# EAGLE design nixie-tube-clock (EAGLE 7.5.0)
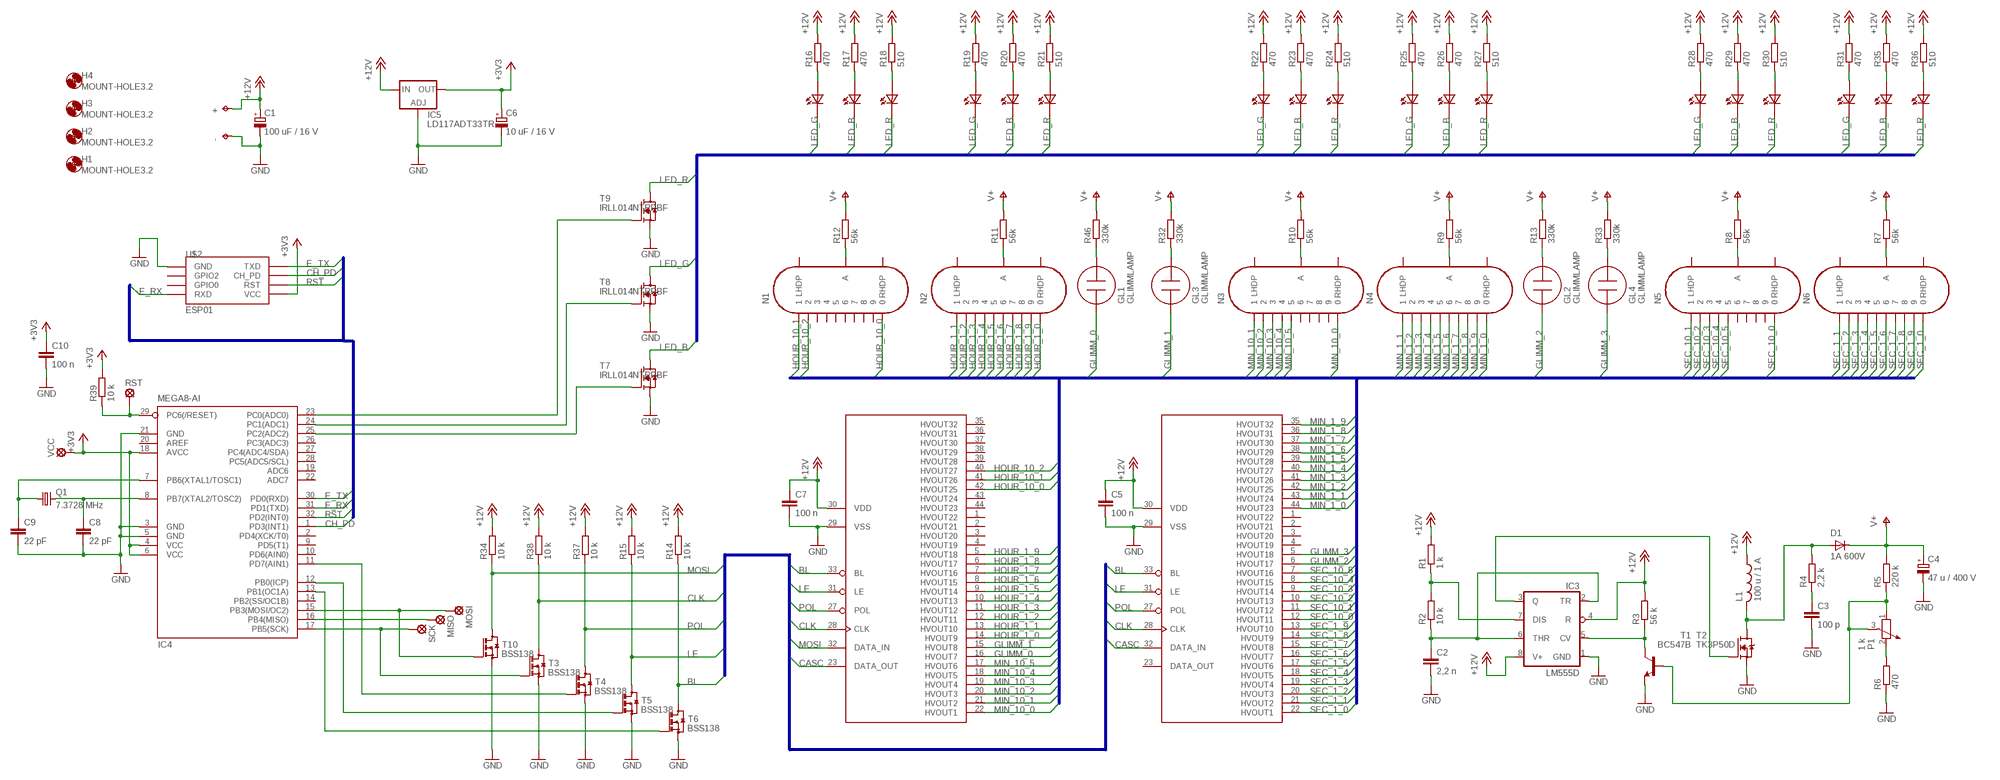
[diagram p0: schematic, sheet 1]

## Parts
+  +  TPPAD1-17  [P1-17]
-  -  TPPAD1-17  [P1-17]
C1  100 uF / 16 V  CPOL-EU153CLV-0605  [153CLV-0605]
C2  2,2 n  C-EUC1206  [C1206]
C3  100 p  C-EUC1206  [C1206]
C4  47 u / 400 V  CPOL-EUE7.5-16  [E7,5-16]
C5  100 n  C-EUC1206  [C1206]
C6  10 uF / 16 V  CPOL-EU153CLV-0405  [153CLV-0405]
C7  100 n  C-EUC1206  [C1206]
C8  22 pF  C-EUC1206  [C1206]
C9  22 pF  C-EUC1206  [C1206]
C10  100 n  C-EUC1206  [C1206]
D1  1A 600V  GF1  [SMA-DO214AC]
GL1  GLIMMLAMP  [GLIMMLAMP]
GL2  GLIMMLAMP  [GLIMMLAMP]
GL3  GLIMMLAMP  [GLIMMLAMP]
GL4  GLIMMLAMP  [GLIMMLAMP]
H1  MOUNT-HOLE3.2  [3,2]
H2  MOUNT-HOLE3.2  [3,2]
H3  MOUNT-HOLE3.2  [3,2]
H4  MOUNT-HOLE3.2  [3,2]
IC1  HV5622QC  [PQFP44]
IC2  HV5622QC  [PQFP44]
IC3  LM555D  [SO08]
IC4  MEGA8-AI  [TQFP32-08]
IC5  LD117ADT33TR  [DPACK]
L1  100 u / 1 A  L_V_8.7X12_RM5.0  [L_V_8.7X12_RM5.0]
MISO  MISO  SE11  [SE11]
MOSI  MOSI  SE11  [SE11]
N1  IN-14  [IN-14]
N2  IN-14  [IN-14]
N3  IN-14  [IN-14]
N4  IN-14  [IN-14]
N5  IN-14  [IN-14]
N6  IN-14  [IN-14]
P1  1 k  POTENTIOMETER_PT-10  [PT-10]
Q1  7.3728 MHz  CRYSTALHC49S  [HC49/S]
R1  1 k  R-EU_R1206  [R1206]
R2  10 k  R-EU_R1206  [R1206]
R3  56 k  R-EU_R1206  [R1206]
R4  2,2 k  R-EU_R1206  [R1206]
R5  220 k  R-EU_R1206  [R1206]
R6  470  R-EU_R1206  [R1206]
R7  56k  R-EU_R1206  [R1206]
R8  56k  R-EU_R1206  [R1206]
R9  56k  R-EU_R1206  [R1206]
R10  56k  R-EU_R1206  [R1206]
R11  56k  R-EU_R1206  [R1206]
R12  56k  R-EU_R1206  [R1206]
R13  330k  R-EU_R1206  [R1206]
R14  10 k  R-EU_R1206  [R1206]
R15  10 k  R-EU_R1206  [R1206]
R16  470  R-EU_R1206  [R1206]
R17  470  R-EU_R1206  [R1206]
R18  510  R-EU_R1206  [R1206]
R19  470  R-EU_R1206  [R1206]
R20  470  R-EU_R1206  [R1206]
R21  510  R-EU_R1206  [R1206]
R22  470  R-EU_R1206  [R1206]
R23  470  R-EU_R1206  [R1206]
R24  510  R-EU_R1206  [R1206]
R25  470  R-EU_R1206  [R1206]
R26  470  R-EU_R1206  [R1206]
R27  510  R-EU_R1206  [R1206]
R28  470  R-EU_R1206  [R1206]
R29  470  R-EU_R1206  [R1206]
R30  510  R-EU_R1206  [R1206]
R31  470  R-EU_R1206  [R1206]
R32  330k  R-EU_R1206  [R1206]
R33  330k  R-EU_R1206  [R1206]
R34  10 k  R-EU_R1206  [R1206]
R35  470  R-EU_R1206  [R1206]
R36  510  R-EU_R1206  [R1206]
R37  10 k  R-EU_R1206  [R1206]
R38  10 k  R-EU_R1206  [R1206]
R39  10 k  R-EU_R1206  [R1206]
R46  330k  R-EU_R1206  [R1206]
RST  RST  SE11  [SE11]
SCK  SCK  SE11  [SE11]
T1  BC547B  BC817-NPN-SOT23-BEC  [SOT23-BEC]
T2  TK3P50D  IRFR320PBF  [TO252]
T3  BSS138  BSS123  [SOT23]
T4  BSS138  BSS123  [SOT23]
T5  BSS138  BSS123  [SOT23]
T6  BSS138  BSS123  [SOT23]
T7  IRLL014NTRPBF  [SOT223]
T8  IRLL014NTRPBF  [SOT223]
T9  IRLL014NTRPBF  [SOT223]
T10  BSS138  BSS123  [SOT23]
U$1  OF-SMD5060RGB  [OF-SMD5060RGB]
U$2  ESP01  [ESP01]
U$3  OF-SMD5060RGB  [OF-SMD5060RGB]
U$4  OF-SMD5060RGB  [OF-SMD5060RGB]
U$5  OF-SMD5060RGB  [OF-SMD5060RGB]
U$6  OF-SMD5060RGB  [OF-SMD5060RGB]
U$7  OF-SMD5060RGB  [OF-SMD5060RGB]
VCC  VCC  SE11  [SE11]

## Nets
+3V3: C6.+ C10.1 IC4.4(VCC) IC4.6(VCC) IC4.18(AVCC) IC5.4(OUT) R39.2 U$2.VCC VCC.MP
+12V: +.TP C1.+ C5.1 C7.1 IC1.30(VDD) IC2.30(VDD) IC3.4(R) IC3.8(V+) IC5.3(IN) L1.P$1 R1.2 R3.2 R14.2 R15.2 R16.2 R17.2 R18.2 R19.2 R20.2 R21.2 R22.2 R23.2 R24.2 R25.2 R26.2 R27.2 R28.2 R29.2 R30.2 R31.2 R34.2 R35.2 R36.2 R37.2 R38.2
BL: IC1.33(BL) IC2.33(BL) R14.1 T6.3(D)
CASC: IC1.23(DATA_OUT) IC2.32(DATA_IN)
CH_PD: IC4.1(PD3(INT1)) U$2.CH_PD
CLK: IC1.28(CLK) IC2.28(CLK) R38.1 T3.3(D)
E_RX: IC4.31(PD1(TXD)) U$2.RX(RXD)
E_TX: IC4.30(PD0(RXD)) U$2.TX(TXD)
GLIMM_0: GL1.C IC1.16(HVOUT7)
GLIMM_1: GL3.C IC1.15(HVOUT8)
GLIMM_2: GL2.C IC2.6(HVOUT17)
GLIMM_3: GL4.C IC2.5(HVOUT18)
GND: -.TP C1.- C2.2 C3.2 C4.- C5.2 C6.- C7.2 C8.2 C9.2 C10.2 IC1.29(VSS) IC2.29(VSS) IC3.1(GND) IC4.3(GND) IC4.5(GND) IC4.21(GND) IC5.1(ADJ) R6.1 T1.E T2.2(S) T3.2(S) T4.2(S) T5.2(S) T6.2(S) T7.3(S) T8.3(S) T9.3(S) T10.2(S) U$2.GND
HOUR_1_0: IC1.14(HVOUT9) N2.0
HOUR_1_1: IC1.13(HVOUT10) N2.1
HOUR_1_2: IC1.12(HVOUT11) N2.2
HOUR_1_3: IC1.11(HVOUT12) N2.3
HOUR_1_4: IC1.10(HVOUT13) N2.4
HOUR_1_5: IC1.9(HVOUT14) N2.5
HOUR_1_6: IC1.8(HVOUT15) N2.6
HOUR_1_7: IC1.7(HVOUT16) N2.7
HOUR_1_8: IC1.6(HVOUT17) N2.8
HOUR_1_9: IC1.5(HVOUT18) N2.9
HOUR_10_0: IC1.42(HVOUT25) N1.0
HOUR_10_1: IC1.41(HVOUT26) N1.1
HOUR_10_2: IC1.40(HVOUT27) N1.2
LE: IC1.31(LE) IC2.31(LE) R15.1 T5.3(D)
LED_B: T7.2(D) T7.4(D) U$1.B_CATH(B:CATH) U$3.B_CATH(B:CATH) U$4.B_CATH(B:CATH) U$5.B_CATH(B:CATH) U$6.B_CATH(B:CATH) U$7.B_CATH(B:CATH)
LED_D0: IC4.23(PC0(ADC0)) T9.1(G)
LED_D1: IC4.24(PC1(ADC1)) T8.1(G)
LED_D2: IC4.25(PC2(ADC2)) T7.1(G)
LED_G: T8.2(D) T8.4(D) U$1.G_CATH(G:CATH) U$3.G_CATH(G:CATH) U$4.G_CATH(G:CATH) U$5.G_CATH(G:CATH) U$6.G_CATH(G:CATH) U$7.G_CATH(G:CATH)
LED_R: T9.2(D) T9.4(D) U$1.R_CATH(R:CATH) U$3.R_CATH(R:CATH) U$4.R_CATH(R:CATH) U$5.R_CATH(R:CATH) U$6.R_CATH(R:CATH) U$7.R_CATH(R:CATH)
MIN_1_0: IC2.44(HVOUT23) N4.0
MIN_1_1: IC2.43(HVOUT24) N4.1
MIN_1_2: IC2.42(HVOUT25) N4.2
MIN_1_3: IC2.41(HVOUT26) N4.3
MIN_1_4: IC2.40(HVOUT27) N4.4
MIN_1_5: IC2.39(HVOUT28) N4.5
MIN_1_6: IC2.38(HVOUT29) N4.6
MIN_1_7: IC2.37(HVOUT30) N4.7
MIN_1_8: IC2.36(HVOUT31) N4.8
MIN_1_9: IC2.35(HVOUT32) N4.9
MIN_10_0: IC1.22(HVOUT1) N3.0
MIN_10_1: IC1.21(HVOUT2) N3.1
MIN_10_2: IC1.20(HVOUT3) N3.2
MIN_10_3: IC1.19(HVOUT4) N3.3
MIN_10_4: IC1.18(HVOUT5) N3.4
MIN_10_5: IC1.17(HVOUT6) N3.5
MOSI: IC1.32(DATA_IN) R34.1 T10.3(D)
N$2: IC4.29(PC6(/RESET)) R39.1 RST.MP
N$3: IC3.7(DIS) R1.1 R2.2
N$4: IC3.5(CV) R3.1 T1.C
N$5: C2.1 IC3.2(TR) IC3.6(THR) R2.1
N$6: IC3.3(Q) T2.1(G)
N$7: D1.A L1.P$2 R4.2 T2.3(D)
N$8: P1.1 P1.3 R5.1 T1.B
N$9: C3.1 R4.1
N$10: P1.2 R6.2
N$11: N1.A R12.1
N$12: N2.A R11.1
N$13: N3.A R10.1
N$14: N4.A R9.1
N$15: N5.A R8.1
N$16: N6.A R7.1
N$17: IC4.16(PB4(MISO)) MISO.MP
N$18: GL2.A R13.1
N$19: IC4.13(PB1(OC1A)) T6.1(G)
N$20: R16.1 U$1.G_ANODE(G:ANODE)
N$21: R17.1 U$1.B_ANODE(B:ANODE)
N$22: R18.1 U$1.R_ANODE(R:ANODE)
N$23: C8.1 IC4.8(PB7(XTAL2/TOSC2)) Q1.2
N$24: GL3.A R32.1
N$26: R19.1 U$3.G_ANODE(G:ANODE)
N$27: R20.1 U$3.B_ANODE(B:ANODE)
N$28: R21.1 U$3.R_ANODE(R:ANODE)
N$29: IC4.12(PB0(ICP)) T5.1(G)
N$30: GL4.A R33.1
N$31: C9.1 IC4.7(PB6(XTAL1/TOSC1)) Q1.1
N$32: R22.1 U$4.G_ANODE(G:ANODE)
N$33: R23.1 U$4.B_ANODE(B:ANODE)
N$34: R24.1 U$4.R_ANODE(R:ANODE)
N$35: IC4.17(PB5(SCK)) SCK.MP T3.1(G)
N$38: R25.1 U$5.G_ANODE(G:ANODE)
N$39: R26.1 U$5.B_ANODE(B:ANODE)
N$40: R27.1 U$5.R_ANODE(R:ANODE)
N$41: IC4.15(PB3(MOSI/OC2)) MOSI.MP T10.1(G)
N$43: IC4.11(PD7(AIN1)) T4.1(G)
N$44: R28.1 U$6.G_ANODE(G:ANODE)
N$45: R29.1 U$6.B_ANODE(B:ANODE)
N$46: R30.1 U$6.R_ANODE(R:ANODE)
N$50: R31.1 U$7.G_ANODE(G:ANODE)
N$51: R35.1 U$7.B_ANODE(B:ANODE)
N$52: R36.1 U$7.R_ANODE(R:ANODE)
N$146: GL1.A R46.1
POL: IC1.27(POL) IC2.27(POL) R37.1 T4.3(D)
RST: IC4.32(PD2(INT0)) U$2.RST
SEC_1_0: IC2.22(HVOUT1) N6.0
SEC_1_1: IC2.21(HVOUT2) N6.1
SEC_1_2: IC2.20(HVOUT3) N6.2
SEC_1_3: IC2.19(HVOUT4) N6.3
SEC_1_4: IC2.18(HVOUT5) N6.4
SEC_1_5: IC2.17(HVOUT6) N6.5
SEC_1_6: IC2.16(HVOUT7) N6.6
SEC_1_7: IC2.15(HVOUT8) N6.7
SEC_1_8: IC2.14(HVOUT9) N6.8
SEC_1_9: IC2.13(HVOUT10) N6.9
SEC_10_0: IC2.12(HVOUT11) N5.0
SEC_10_1: IC2.11(HVOUT12) N5.1
SEC_10_2: IC2.10(HVOUT13) N5.2
SEC_10_3: IC2.9(HVOUT14) N5.3
SEC_10_4: IC2.8(HVOUT15) N5.4
SEC_10_5: IC2.7(HVOUT16) N5.5
V+: C4.+ D1.K(C) R5.2 R7.2 R8.2 R9.2 R10.2 R11.2 R12.2 R13.2 R32.2 R33.2 R46.2
Unconnected: IC1.1(HVOUT22) IC1.2(HVOUT21) IC1.3(HVOUT20) IC1.4(HVOUT19) IC1.35(HVOUT32) IC1.36(HVOUT31) IC1.37(HVOUT30) IC1.38(HVOUT29) IC1.39(HVOUT28) IC1.43(HVOUT24) IC1.44(HVOUT23) IC2.1(HVOUT22) IC2.2(HVOUT21) IC2.3(HVOUT20) IC2.4(HVOUT19) IC2.23(DATA_OUT) IC4.2(PD4(XCK/T0)) IC4.9(PD5(T1)) IC4.10(PD6(AIN0)) IC4.14(PB2(SS/OC1B)) IC4.19(ADC6) IC4.20(AREF) IC4.22(ADC7) IC4.26(PC3(ADC3)) IC4.27(PC4(ADC4/SDA)) IC4.28(PC5(ADC5/SCL)) N1.3 N1.4 N1.5 N1.6 N1.7 N1.8 N1.9 N1.LHDP N1.RHDP N2.LHDP N2.RHDP N3.6 N3.7 N3.8 N3.9 N3.LHDP N3.RHDP N4.LHDP N4.RHDP N5.6 N5.7 N5.8 N5.9 N5.LHDP N5.RHDP N6.LHDP N6.RHDP U$2.GPIO0 U$2.GPIO2

## Buses
SEC_1_[0..9],SEC_10_[0..5],MIN_1_[0..9],MIN_10_[0..5],HOUR_1_[0..9],HOUR_10_[0..2],GLIMM_[0..3]
LED_R,LED_G,LED_B
CLK,BL,LE,MOSI,CASC,POL
RST,E_RX,E_TX,CH_PD

## Library data of the parts
+ - = testpad:TP: Test pad
C1 C4 C6 = resistor:CPOL-EU: POLARIZED CAPACITOR, European symbol
C2 = rcl:C-EU: CAPACITOR, European symbol
C3 C5 C7-C10 = resistor:C-EU: CAPACITOR, European symbol
D1 = diode:GF1: DIODE
GL1-GL4 = 00_own:GLIMMLAMP
H1-H4 = holes:MOUNT-HOLE: MOUNTING HOLE with drill center marker
IC1 IC2 = microchip-hv5622:HV5622
IC3 = linear:*555: TIMER
IC4 = atmel:MEGA8: MICROCONTROLLER 8 Kbytes FLASH, 1 kbytes SRAM, 512 bytes EEPROM, USART, 6-channel 10 bit ADC, 2-channel 8 bit ADC Pin compatible with Atmega48, ATMega88, ATMega168 Source: avr.lbr; MPN: ATMEGA8-16AU; OC_FARNELL: 9171371; OC_NEWARK: 73M8863
IC5 = v-reg:LD117A?*: Low drop fixed and adjustable positive voltage regulators 1 A Source: http://www.st.com/stonline/products/literature/ds/7194/ld1117axx.pdf
L1 = 00_own:L_V_8.7X12_RM5.0
MISO MOSI RST SCK VCC = solpad:SE11: SOLDER PAD RTM, drill 1,1mm, distributor Buerklin, 07F810
N1-N6 = russian-nixies:IN-14: IN-14: medium numeric frontview nixie tube
P1 = rcl:POTENTIOMETER_: Potentiometer
Q1 = crystal:CRYSTAL: CRYSTAL; OC_FARNELL: 1667008; OC_NEWARK: unknown
R1-R39 R46 = resistor:R-EU_: RESISTOR, European symbol
T1 = transistor:*-NPN-: NPN Transistror BF959 corrected 2008.03.06
T2 = transistor-fet:IRFR320PBF
T3-T6 T10 = transistor-small-signal:BSS123: N-CHANNEL MOS FET
T7-T9 = transistor-fet:IRLL014NTRPBF
U$1 U$3-U$7 = 00_own:OF-SMD5060RGB
U$2 = esp8266modules:ESP01: ESP8266 Wifi module 01

## Board
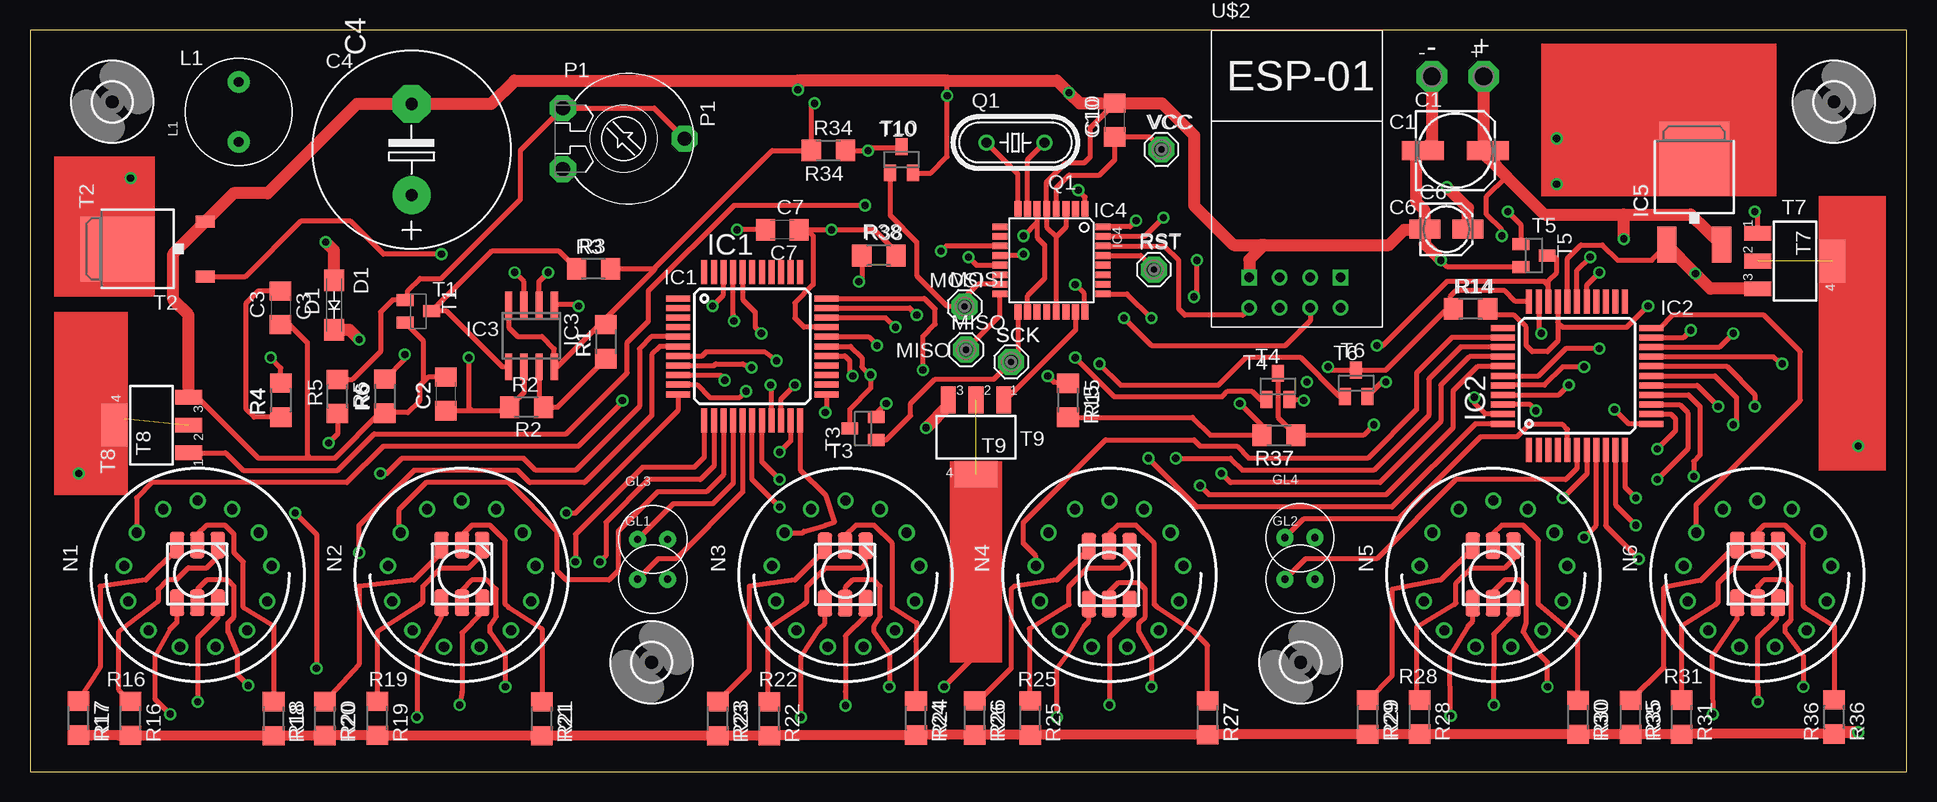
[diagram p1: board, top side]
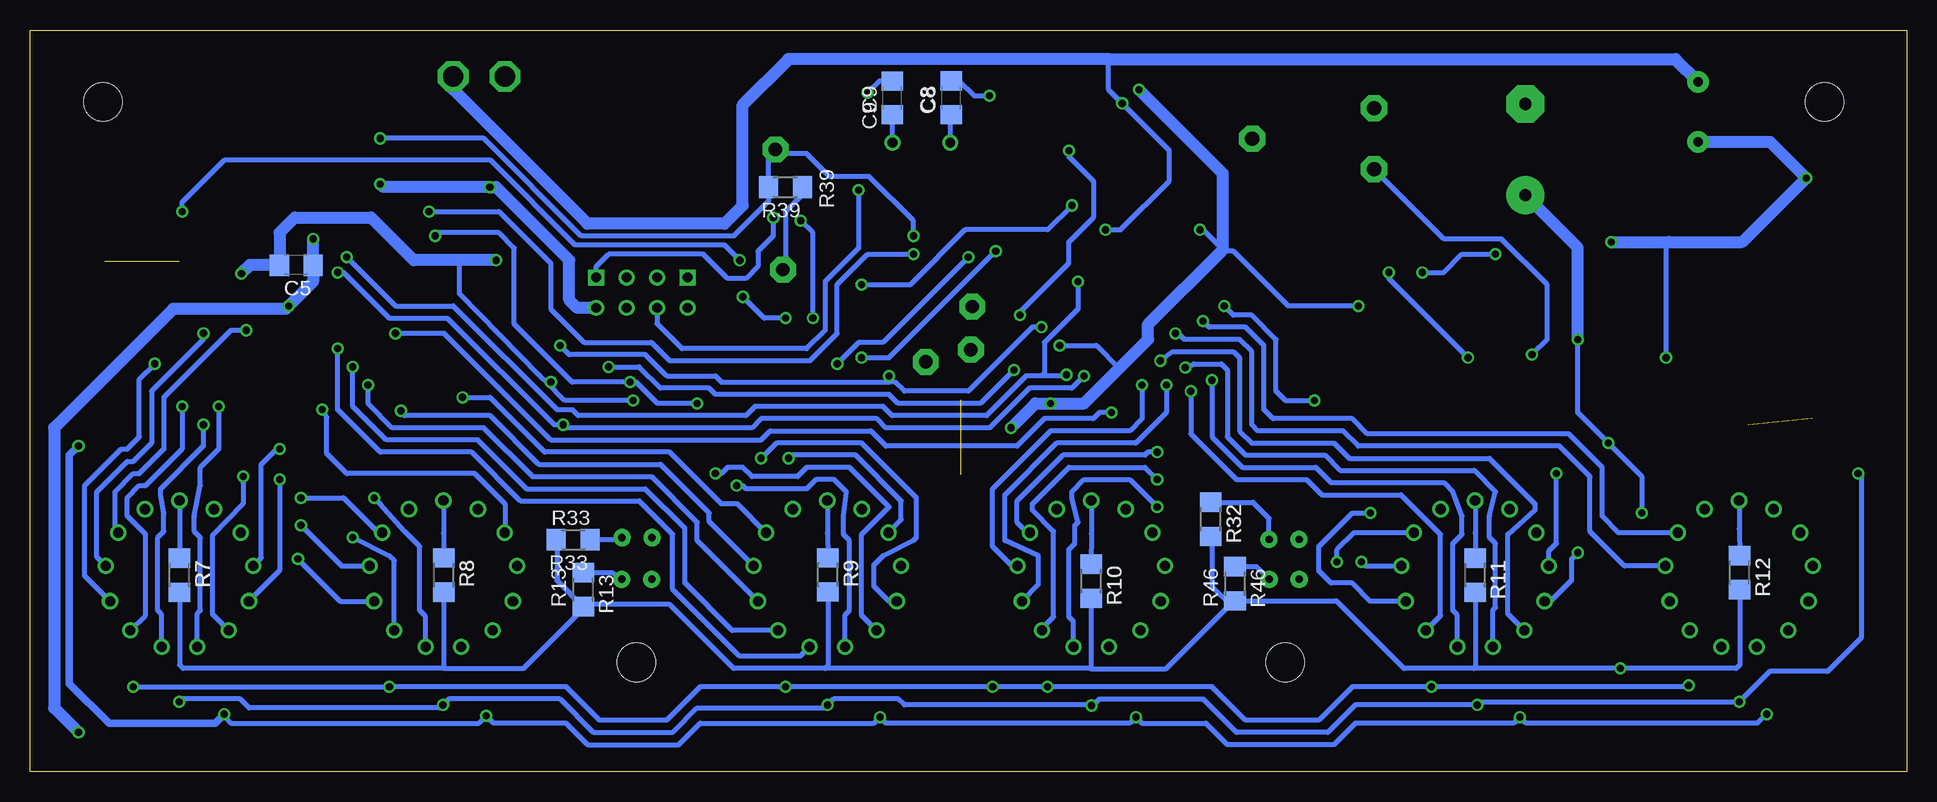
[diagram p2: board, bottom side, seen from below]

Size 156.44 x 61.87 mm. Coordinates in mm from the lower left corner, seen from the top.
Outline: 0,0 156.44,0 156.44,61.87 0,61.87 0,0
Copper layers (1*16): Top 0.035mm / dielectric 1.5mm / Bottom 0.035mm
Design rules "NYAKARUHAZ_StandardNYAK": minimum track width 6mil, minimum drill 12mil, track to track 6mil, track to pad 6mil, pad to pad 6mil, via to via 6mil, smd to smd 6mil, copper to edge 20mil, drill to drill 8mil, minimum pad ring 10mil, minimum via ring 8mil, stop-mask expansion 4mil, vias tented up to drill 0mil, thermal gap 6mil

### Footprints (pad centres in the part's own frame; a part is rotated, then mirrored left to right if it is on the bottom)
P1-17 = drill 1.702 pad 2.54 octagon: TP 0,0
153CLV-0605 = smd 3.5 x 1.6: + 2.7,0; - -2.7,0
C1206 = smd 1.6 x 1.8: 1 -1.4,0; 2 1.4,0
E7,5-16 = drill 1.016 pad 3.15: + -3.81,0 | drill 1.016 pad 3.15 octagon: - 3.81,0
153CLV-0405 = smd 2.6 x 1.6: + 1.8,0; - -1.8,0
SMA-DO214AC = smd 1.8 x 1.7: A -2.05,0; K 2.05,0
GLIMMLAMP = drill 0.6 pad 1.422: A 0,1; C 0,-1.5
3,2 = hole 3.2: 0,0
PQFP44 = smd 2 x 0.5: 1 -6.2,4; 2 -6.2,3.2; 3 -6.2,2.4; 4 -6.2,1.6; 5 -6.2,0.8; 6 -6.2,0; 7 -6.2,-0.8; 8 -6.2,-1.6; 9 -6.2,-2.4; 10 -6.2,-3.2; 11 -6.2,-4; 23 6.2,-4; 24 6.2,-3.2; 25 6.2,-2.4; 26 6.2,-1.6; 27 6.2,-0.8; 28 6.2,0; 29 6.2,0.8; 30 6.2,1.6; 31 6.2,2.4; 32 6.2,3.2; 33 6.2,4 | smd 0.5 x 2: 12 -4,-6.2; 13 -3.2,-6.2; 14 -2.4,-6.2; 15 -1.6,-6.2; 16 -0.8,-6.2; 17 0,-6.2; 18 0.8,-6.2; 19 1.6,-6.2; 20 2.4,-6.2; 21 3.2,-6.2; 22 4,-6.2; 34 4,6.2; 35 3.2,6.2; 36 2.4,6.2; 37 1.6,6.2; 38 0.8,6.2; 39 0,6.2; 40 -0.8,6.2; 41 -1.6,6.2; 42 -2.4,6.2; 43 -3.2,6.2; 44 -4,6.2
SO08 = smd 0.6 x 2.2: 1 -1.905,-2.6; 2 -0.635,-2.6; 3 0.635,-2.6; 4 1.905,-2.6; 5 1.905,2.6; 6 0.635,2.6; 7 -0.635,2.6; 8 -1.905,2.6
TQFP32-08 = smd 1.27 x 0.559: 1 -4.293,2.8; 2 -4.293,2; 3 -4.293,1.2; 4 -4.293,0.4; 5 -4.293,-0.4; 6 -4.293,-1.2; 7 -4.293,-2; 8 -4.293,-2.8; 17 4.293,-2.8; 18 4.293,-2; 19 4.293,-1.2; 20 4.293,-0.4; 21 4.293,0.4; 22 4.293,1.2; 23 4.293,2; 24 4.293,2.8 | smd 0.559 x 1.27: 9 -2.8,-4.293; 10 -2,-4.293; 11 -1.2,-4.293; 12 -0.4,-4.293; 13 0.4,-4.293; 14 1.2,-4.293; 15 2,-4.293; 16 2.8,-4.293; 25 2.8,4.293; 26 2,4.293; 27 1.2,4.293; 28 0.4,4.293; 29 -0.4,4.293; 30 -1.2,4.293; 31 -2,4.293; 32 -2.8,4.293
DPACK = smd 1.6 x 3: 1 -2.28,-4.8; 3 2.28,-4.8 | smd 5.8 x 6.2: 4 0,2.38
L_V_8.7X12_RM5.0 = drill 0.8 pad 1.8: P$1 0,2; P$2 0,-3
SE11 = drill 1.118 pad 2.159 octagon: MP 0,0
IN-14 = drill 0.84: 0 5.094,-3.516; 1 -5.094,-3.516; 2 -6.145,-0.746; 3 -5.788,2.195; 4 -4.105,4.633; 5 -1.481,6.01; 6 1.481,6.01; 7 4.105,4.633; 8 5.788,2.195; 9 6.145,-0.746; A 0,-6.19; LHDP 2.877,-5.481; RHDP -2.877,-5.481
PT-10 = drill 1.2 pad 2.2 octagon: 1 -2.54,-5.08; 2 2.54,-5.08; 3 0,5.08
HC49/S = drill 0.813: 1 -2.413,0; 2 2.413,0
R1206 = smd 1.6 x 1.803: 1 -1.422,0; 2 1.422,0
SOT23-BEC = smd 1 x 1.4: B -0.95,-1.1; C 0,1.1; E 0.95,-1.1
TO252 = smd 1 x 1.6: 1 -2.28,-4.8; 2 2.28,-4.8 | smd 5.4 x 6.2: 3 0,2.5
SOT23 = smd 1 x 1.4: 1 -0.95,-1.1; 2 0.95,-1.1; 3 0,1.1
SOT223 = smd 1.219 x 2.235: 1 -2.311,-3.099; 2 0,-3.099; 3 2.311,-3.099 | smd 3.6 x 2.2: 4 0,3.099
OF-SMD5060RGB = smd 1.2 x 2.2: B_ANODE 4,1.1; B_CATH 4,5.9; G_ANODE 0.6,1.1; G_CATH 0.6,5.9; R_ANODE 2.3,1.1; R_CATH 2.3,5.9
ESP01 = drill 0.8: CH_PD -1.285,-8.178; GPIO0 1.255,-5.638; GPIO2 -1.285,-5.638; RST 1.255,-8.178; TX -3.825,-8.178; VCC 3.795,-8.178 | drill 0.8 square: GND -3.825,-5.638; RX 3.795,-5.638

### Placement (x,y rotation side)
+  121.18,58.01 0 top
-  116.85,58.01 0 top
C1  118.8,51.81 0 top
C2  34.68,31.53 90 top
C3  20.88,38.71 270 top
C4  31.8,51.9 90 top
C5  134.25,42.26 180 bottom
C6  118.06,45.26 0 top
C7  62.71,45.21 180 top
C8  79.66,56.21 90 bottom
C9  84.57,56.21 90 bottom
C10  90.42,54.36 90 top
D1  25.35,38.94 270 top
GL1  52.15,16.08 270 top
GL2  106.12,16.08 270 top
GL3  52.16,19.39 270 top
GL4  106.11,19.54 270 top
H1  51.82,9.14 0 top
H2  6.86,55.88 0 top
H3  150.37,55.88 0 top
H4  105.92,9.14 0 top
IC1  60.21,35.49 0 top
IC2  128.95,33.04 90 top
IC3  41.8,36.38 180 top
IC4  85.15,42.66 270 top
IC5  138.73,48.76 0 top
L1  17.4,55.55 0 top
MISO  78.02,35.21 0 top
MOSI  77.9,38.81 0 top
N1  13.98,16.44 180 top
N2  35.98,16.44 180 top
N3  67.98,16.44 180 top
N4  89.98,16.44 180 top
N5  121.98,16.44 180 top
N6  143.98,16.44 180 top
P1  49.49,52.81 270 top
Q1  82.14,52.48 180 top
R1  48.01,35.88 90 top
R2  41.39,30.43 0 top
R3  46.98,41.97 0 top
R4  20.91,31.01 90 top
R5  25.64,31.31 270 top
R6  29.59,31.34 90 top
R7  143.98,16.4 270 bottom
R8  121.94,16.42 270 bottom
R9  89.94,16.43 270 bottom
R10  67.99,15.91 270 bottom
R11  35.99,16.4 270 bottom
R12  13.94,16.62 270 bottom
R13  110.33,15.2 270 bottom
R14  120.08,38.62 0 top
R15  86.53,31 270 top
R16  8.38,4.48 270 top
R17  4.03,4.49 270 top
R18  20.32,4.45 270 top
R19  28.96,4.48 270 top
R20  24.59,4.46 270 top
R21  42.65,4.44 270 top
R22  61.61,4.44 270 top
R23  57.33,4.45 270 top
R24  73.85,4.5 270 top
R25  83.37,4.5 270 top
R26  78.74,4.5 270 top
R27  98.17,4.52 270 top
R28  115.82,4.58 270 top
R29  111.51,4.57 270 top
R30  129.03,4.55 270 top
R31  137.68,4.57 270 top
R32  58.03,21.07 270 bottom
R33  111.18,19.37 180 bottom
R34  66.55,51.82 180 top
R35  133.41,4.56 270 top
R36  150.38,4.59 270 top
R37  104.1,28.07 180 top
R38  70.76,43.06 0 top
R39  93.47,48.77 180 bottom
R46  56,15.7 270 bottom
RST  93.68,41.89 0 top
SCK  81.78,34.19 0 top
T1  32.38,38.42 270 top
T2  9.81,43.61 90 top
T3  69.44,28.64 90 top
T4  104.02,32.15 0 top
T5  125.36,43.07 270 top
T6  110.54,32.41 0 top
T7  147.11,42.6 270 top
T8  10.12,28.93 90 top
T9  78.85,27.92 180 top
T10  72.64,51.05 0 top
U$1  16.26,20.02 180 top
U$2  105.46,46.87 0 top
U$3  38.3,20.02 180 top
U$4  70.26,19.96 180 top
U$5  92.25,19.91 180 top
U$6  124.26,19.96 180 top
U$7  146.3,20.02 180 top
VCC  94.31,51.91 0 top

### Tracks (layer width: path | path; a pad name or v marks a point on that pad's centre or on a via)
+3V3  (via drill 0.6)
  Top 0.406: IC5.4 135.42,51.09 133.1,48.77 | IC4.18 83.15,39.71 84.58,41.15 84.58,43.94 83.95,44.58 IC4.6 83.95,45.85 v82.8,44.7 | v127.25,52.83 v127.25,49.02 | VCC.MP 93.32,52.96 C10.1 90.42,51.05 89.15,49.78 86.61,49.78 85.55,48.72 IC4.4
  Top 1.016: C6.+ 119.86,47.02 v118.11,48.77 | 127.75,49 v127.25,49.02 127.73,49.02 127.75,49 | 127.75,49 133.1,48.77
  Bottom 0.406: v127.25,52.83 118.62,52.83 110.49,44.7 97.79,44.7 94.89,47.6 R39.2 94.89,51.32 VCC.MP 93.96,51.56 91.69,51.56 89.79,49.66 86.49,49.66 82.8,45.97 v82.8,44.7
  Bottom 1.016: U$2.VCC 110.83,38.69 111.51,39.37 111.51,42.67 117.6,48.77 v118.11,48.77 127,48.77 v127.25,49.02
+12V  (via drill 0.6)
  Top 0.406: IC2.30 127.35,37.49 | 127.35,37.49 127.76,37.08 133.1,37.08 v134.87,38.86 | 127.35,37.49 127.35,35.91 126.49,35.05 125.22,35.05 124.71,35.56 124.71,37.08 123.7,38.1 122.02,38.1 R14.2 | v122.68,44.7 122.68,45.21 121.41,46.48 121.41,48.01 123.06,49.66 | C7.1 64.77,45.21 | 64.77,45.21 65.28,44.7 65.28,40.64 63.76,39.12 63.76,37.84 64.51,37.09 IC1.30 | 64.77,45.21 v66.8,45.21 | v66.8,45.21 | R3.2 52.01,41.97 | 52.01,41.97 52.07,41.91 48.01,37.85 R1.2 47.46,37.3 43.94,33.78 IC3.8 43.71,35.29 42.67,36.32 40.64,36.32 39.9,37.06 IC3.4 | R15.2 96.91,29.58 98.42,28.07 R37.2 102.68,28.89 v100.84,30.73 | v66.8,45.21 70.36,45.21 72.18,43.39 R38.2 | 52.01,41.97 61.86,51.82 R34.2 65.13,55.47 v65.41,55.75
  Top 0.813: R36.2 137.7,3.16 R31.2 R35.2 R30.2 115.85,3.13 R28.2 R29.2 98.22,3.15 R27.2 83.38,3.1 R25.2 R26.2 | R26.2 | R26.2 R24.2 61.67,3.08 R22.2 57.33,3.02 R23.2 42.66,3.02 R21.2 29,3.02 R19.2 24.61,3.06 R20.2 20.33,3.03 R18.2 7.39,3.02 R16.2 5.07,3.06 R17.2
  Top 1.016: 132.84,46.48 126.24,46.48 123.06,49.66 121.5,51.22 C1.+ 121.18,52.14 +.TP | 132.84,46.48 138.43,46.48 IC5.3 | v132.84,44.45 132.84,46.48 | v152.4,3.3 150.51,3.3 R36.2
  Bottom 0.406: 132.75,42.16 C5.1 | v132.85,44.44 v132.84,44.45 | v122.68,44.7 122.43,44.96 117.35,44.96 116.08,43.69 116.08,37.34 111.25,32.51 v106.43,32.51 105.92,32.51 104.14,30.73 v100.84,30.73 | v134.87,38.86 135.13,38.86 135.38,38.61 | v66.8,45.21 65.53,45.21 61.47,49.28 61.47,51.82 v65.41,55.75 65.79,56.13 66.55,56.9 66.55,59.44
  Bottom 1.016: v132.85,44.44 C5.1 132.85,40.89 v134.87,38.86 135.13,38.61 135.38,38.61 144.53,38.61 154.43,28.7 154.43,5.33 v152.4,3.3 | +.TP 121.18,56.91 109.98,45.72 98.55,45.72 97.03,47.24 97.03,55.63 93.22,59.44 66.55,59.44 19.28,59.44 L1.P$1 17.42,57.55
BL  (via drill 0.6)
  Top 0.406: IC2.33 123.83,39.24 122.94,40.13 118.87,40.13 118.36,39.62 118.36,38.84 R14.1 118.15,38.65 113.01,33.51 T6.3 | IC1.33 74.56,39.49 75.44,38.61 75.44,37.34 74.42,36.32 v74.42,33.53 | 110.26,33.78 T6.3 | v108.2,33.78 108.46,33.53 110.52,33.53 T6.3
  Bottom 0.406: v108.2,33.78 105.66,33.78 103.89,32 99.82,32 99.31,31.5 84.84,31.5 84.07,30.73 77.22,30.73 v74.42,33.53
CASC  (via drill 0.6)
  Top 0.406: IC2.32 125.75,36.81 v125.98,36.58 | IC1.23 66.41,30.08 v66.29,29.97
  Bottom 0.406: v125.98,36.58 121.92,36.58 113.03,27.69 95.5,27.69 94.74,28.45 86.36,28.45 85.09,27.18 74.17,27.18 71.88,29.46 67.82,29.46 67.31,29.97 v66.29,29.97
CH_PD  (via drill 0.6)
  Top 0.406: IC4.1 87.95,47.94 v87.38,48.51
  Bottom 0.406: U$2.CH_PD 104.17,37.37 102.11,35.31 91.69,35.31 90.17,36.83 90.17,40.89 87.38,43.69 v87.38,48.51
CLK  (via drill 0.6)
  Top 0.406: IC2.28 128.95,41.83 v130.05,42.93 | IC1.28 68.4,35.49 69.34,34.54 69.34,33.78 v70.05,33.12 70.1,33.07 70.1,32 68.34,30.24 T3.3 | R38.1 69.34,41.14 v69.09,40.89
  Bottom 0.406: v70.05,33.12 70.16,33.02 72.14,33.02 | 72.14,33.02 73.41,33.02 76.71,29.72 84.58,29.72 85.34,30.48 96.01,30.48 96.77,29.72 110.74,29.72 111.25,30.23 112.52,30.23 121.16,38.86 125.98,38.86 v130.05,42.93 | v69.09,40.89 69.09,38.61 71.88,35.81 71.88,33.27 72.14,33.02
E_RX  (via drill 0.6)
  Top 0.406: IC4.31 92.92,44.66 v94.49,46.23
  Bottom 0.406: U$2.RX 109.25,42.13 108.2,43.18 100.33,43.18 98.3,41.15 96.77,41.15 95.76,42.16 95.76,43.43 94.49,44.7 v94.49,46.23
E_TX
  Top 0.406: IC4.30 94.57,43.86 95.76,42.67 95.76,38.61 96.27,38.1 101.09,38.1 101.64,38.64 U$2.TX
GLIMM_0
  Top 0.406: IC1.16 59.41,23.34 53.85,17.78 52.36,17.78 GL1.C
GLIMM_1
  Top 0.406: IC1.15 58.61,24.06 56.9,22.35 53.62,22.35 GL3.C
GLIMM_2
  Top 0.406: IC2.6 128.95,25.32 128.02,24.38 118.87,24.38 112.27,17.78 106.32,17.78 GL2.C
GLIMM_3
  Top 0.406: IC2.5 128.15,28.56 127.76,28.96 124.97,28.96 123.95,27.94 120.9,27.94 114.05,21.08 106.15,21.08 GL4.C
GND  (via drill 0.6)
  Top 0.406: IC2.29 128.15,42.81 129.29,43.94 131.06,43.94 132.33,42.67 135.21,42.67 IC5.1 | IC1.29 69.88,36.29 v70.61,35.56 | C7.2 v58.93,45.21 | IC4.21 85.55,44.65 | IC4.3 86.35,45.45 85.55,44.65 | 85.55,44.65 84.75,45.45 IC4.5 84.75,49.19 86.36,50.8 87.88,50.8 88.39,51.31 88.39,53.72 C10.2 | T1.E 32.77,35.98 32.77,32.51 | 32.77,32.51 32.51,32.26 32.51,30.99 31.5,29.97 29.64,29.97 R6.1 29.15,29.92 25.4,26.16 23.37,26.16 | 32.77,32.51 33.18,32.93 C2.2 | v45.72,38.86 45.61,38.98 IC3.1 | T5.2 118.16,42.12 v117.6,42.67 | v113.03,32.51 112.69,32.51 T6.2 | T4.2 106.11,31.05 v106.17,30.99 | T3.2 70.54,29.9 v71.37,30.73 | 23.37,26.16 19.05,26.16 13.97,31.24 T8.3 | C3.2 21.62,37.31 23.11,35.81 23.11,26.42 23.37,26.16 | T10.2 75.1,49.95 76.45,51.31 v76.45,56.39 76.45,57.66
  Top 1.016: -.TP 116.85,52.56 C1.- 115.57,51.28 115.57,47.5 116.26,46.81 C6.- | T7.3 140.06,40.29 138.95,41.42 | C6.- 116.26,44.01 v117.6,42.67 | 138.95,41.42 v138.82,41.55 | v138.82,41.55 IC5.1 | 102.74,43.81 101.64,42.71 U$2.GND | 102.74,43.81 102.87,43.94 113.28,43.94 114.55,45.21 116.21,45.21 C6.- | T9.3 76.54,30.57 v74.68,28.7 | v138.82,41.55 138.95,41.42 | 102.74,43.81 102.62,43.94 100.33,43.94 97.03,47.24 97.03,53.09 94.36,55.76 C10.2 87.5,55.76 v86.61,56.64 85.6,57.66 76.45,57.66 64.01,57.66 | T8.3 13.22,38.09 11.94,39.37 11.94,43.22 T2.2 16.98,48.26 19.81,48.26 27.26,55.71 C4.- 38.44,55.71 40.39,57.66 64.01,57.66 | 64.01,57.66 v64.01,56.9
  Bottom 0.406: 120.65,42.67 120.65,39.88 113.94,33.07 113.39,32.51 | v70.61,35.56 67.56,35.56 65.66,33.66 | v58.93,45.21 58.67,45.21 57.02,43.56 | v45.72,38.86 51.56,38.86 56.13,43.43 57.15,43.43 | 113.39,32.51 v113.03,32.51 | 113.39,32.51 111.86,30.99 v106.17,30.99 | C9.2 85.64,57.61 v86.61,56.64 | C8.2 78.95,57.61 77.72,56.39 v76.45,56.39
  Bottom 1.016: v117.6,42.67 120.65,42.67 124.46,42.67 128.02,46.23 134.37,46.23 135.64,44.96 135.64,42.27 | 135.64,42.27 C5.2 | v74.68,28.7 72.64,30.73 v71.37,30.73 68.58,30.73 65.66,33.66 63.25,36.07 63.25,37.34 57.15,43.43 57.02,43.56 57.02,49.91 v64.01,56.9 | 135.64,42.27 138.1,42.27 v138.82,41.55
HOUR_1_0
  Top 0.406: IC1.14 57.81,24.79 56.39,23.37 52.32,23.37 49.02,20.07 49.02,16.76 48.26,16 44.7,16 43.94,16.76 43.94,20.07 39.88,24.13 33.02,24.13 30.73,21.84 30.73,20.11 N2.0
HOUR_1_1  (via drill 0.6)
  Top 0.406: IC1.13 57.01,25.51 55.88,24.38 51.56,24.38 48.01,20.83 48.01,18.03 v47.5,17.53
  Bottom 0.406: v47.5,17.53 47.5,18.54 46.09,19.95 N2.1
HOUR_1_2  (via drill 0.6)
  Top 0.406: IC1.12 56.21,26.23 55.37,25.4 51.05,25.4 45.47,19.81 v45.47,17.53
  Bottom 0.406: v45.47,17.53 45.12,17.18 N2.2
HOUR_1_3  (via drill 0.6)
  Top 0.406: v44.7,21.59 45.47,21.59 54.01,30.13 IC1.11
  Bottom 0.406: N2.3 44.72,14.24 46.23,15.75 48.01,15.75 49.02,16.76 49.02,18.8 46.23,21.59 v44.7,21.59
HOUR_1_4  (via drill 0.6)
  Top 0.406: IC1.10 55.59,32.29 56.64,31.24 59.18,31.24 v59.69,31.75
  Bottom 0.406: N2.4 38.86,13.03 38.86,19.81 42.16,23.11 48.77,23.11 50.04,24.38 55.88,24.38 59.69,28.19 v59.69,31.75
HOUR_1_5  (via drill 0.6)
  Top 0.406: IC1.9 57.59,33.09 v57.91,32.66
  Bottom 0.406: N2.5 37.47,13.08 37.85,13.46 37.85,19.05 37.08,19.81 37.08,21.34 37.85,23.37 38.61,24.13 48.01,24.13 49.28,25.4 55.37,25.4 57.91,27.94 v57.91,32.66
HOUR_1_6  (via drill 0.6)
  Top 0.406: IC1.8 57,33.89 57.15,34.04 59.44,34.04 v60.15,33.73
  Bottom 0.406: N2.6 34.5,13.5 34.29,13.72 34.29,19.05 34.8,19.56 34.8,21.34 34.29,23.37 36.07,25.15 47.24,25.15 48.51,26.42 55.12,26.42 56.64,27.94 56.64,33.53 57.15,34.04 59.44,34.04 v60.15,33.73
HOUR_1_7  (via drill 0.6)
  Top 0.406: IC1.7 56.03,34.69 56.39,35.05 61.21,35.05 v62.23,34.29
  Bottom 0.406: N2.7 33.27,13.2 33.27,19.81 30.99,21.84 30.99,22.35 34.8,26.16 46.48,26.16 47.75,27.43 54.61,27.43 55.63,28.45 55.63,34.54 56.13,35.05 61.21,35.05 v62.23,34.29
HOUR_1_8  (via drill 0.6)
  Top 0.406: IC1.6 52.51,35.49 51.82,34.8 51.82,29.72 46.23,24.13 41.66,24.13 40.64,25.15 32,25.15 27.43,20.57 v27.43,18.29
  Bottom 0.406: N2.8 29.7,14.24 27.94,16 27.94,17.78 v27.43,18.29
HOUR_1_9  (via drill 0.6)
  Top 0.406: IC1.5 51.78,36.29 50.8,35.31 50.8,30.48 45.47,25.15 42.16,25.15 41.15,26.16 30.99,26.16 29.72,24.89 v29.21,24.89
  Bottom 0.406: N2.9 29.84,18.42 29.21,19.05 v29.21,24.89
HOUR_10_0  (via drill 0.6)
  Top 0.406: v56.9,38.86 57.81,39.77 IC1.42 | N1.0 8.89,22.86 10.16,24.13 26.42,24.13 29.46,27.18 45.72,27.18 49.38,30.84 v49.38,30.99
  Bottom 0.406: v56.9,38.86 56.13,38.1 54.61,38.1 52.58,36.07 52.58,31.75 51.82,30.99 v49.38,30.99
HOUR_10_1  (via drill 0.6)
  Top 0.406: v58.67,37.59 58.61,38.17 IC1.41
  Bottom 0.406: N1.1 24.02,19.95 25.4,21.34 25.4,25.4 28.19,28.19 44.96,28.19 46.23,29.46 52.83,29.46 53.59,30.23 53.59,35.56 55.12,37.08 58.17,37.08 v58.67,37.59
HOUR_10_2  (via drill 0.6)
  Top 0.406: IC1.40 59.41,39.4 60.45,38.35 60.45,37.08 v60.96,36.58
  Bottom 0.406: N1.2 23.53,17.18 26.42,20.07 26.42,24.64 28.96,27.18 45.72,27.18 46.99,28.45 54.1,28.45 54.61,28.96 54.61,35.05 55.63,36.07 60.2,36.07 60.71,36.58 v60.96,36.58
LE  (via drill 0.6)
  Top 0.406: T5.3 127.25,42.84 127.25,41.66 126.55,40.96 IC2.31 126.55,40.58 126.24,40.89 118.11,40.89 112.78,35.56 v112.27,35.56 | IC1.31 71.33,37.89 v72.14,37.08 | R15.1 86.53,32.6 | 85.93,33.02 R15.1 | v84.84,33.02 85.34,32.51 86.44,32.51 R15.1
  Bottom 0.406: v72.14,37.08 72.9,37.08 78.23,31.75 83.57,31.75 84.33,32.51 84.84,32.51 | v112.27,35.56 111.51,34.8 105.16,34.8 103.38,33.02 99.31,33.02 98.81,32.51 84.84,32.51 | 84.84,32.51 v84.84,33.02
LED_B  (via drill 0.6)  (1 unrouted)
  Top 0.406: v140.26,4.83 140.21,9.65 142.24,12.7 142.3,12.76 U$7.B_CATH | v118.42,4.67 118.36,9.65 119.89,12.19 120.26,12.56 U$6.B_CATH | v85.6,4.57 85.6,8.64 86.36,9.65 87.88,12.19 88.25,12.56 U$5.B_CATH | v32.26,4.57 32.26,9.65 34.04,12.45 34.3,12.97 U$3.B_CATH | v64.26,4.57 64.26,9.65 65.79,11.94 66.26,12.41 U$4.B_CATH | v11.68,4.83 10.41,6.1 10.41,9.65 11.68,11.94 12.26,12.51 U$1.B_CATH
  Top 0.61: T7.4 149.81,29.77 v152.4,27.18
  Bottom 0.406: v11.68,4.83 12.45,4.06 31.75,4.06 v32.26,4.57 32.77,4.06 45.97,4.06 47.75,2.29 56.64,2.29 58.42,4.06 63.75,4.06 v64.26,4.57 64.77,4.06 85.09,4.06 v85.6,4.57 86.11,4.06 100.58,4.06 102.36,2.29 109.98,2.29 111.76,4.06 117.81,4.06 v118.42,4.67 119.02,4.06 139.7,4.06 140.26,4.62 v140.26,4.83
  Bottom 0.61: v152.4,27.18 153.16,26.42 153.16,7.37 149.86,4.06 141.02,4.06 v140.26,4.83
LED_D0
  Top 0.406: IC4.23 87.15,36.85 81.31,31.01 T9.1
LED_D1  (via drill 0.6)
  Top 0.406: IC4.24 87.9,38.37 87.88,38.35 87.88,39.88 v87.12,40.64 | T8.1 16.31,26.61 17.78,25.15 25.65,25.15 28.7,28.19 44.7,28.19 49.78,33.27 49.78,35.81 51.56,37.59 51.56,40.13 58.67,47.24 v69.6,47.24
  Bottom 0.406: v87.12,40.64 83.06,40.64 78.49,45.21 71.63,45.21 v69.6,47.24
LED_D2  (via drill 0.6)
  Top 0.406: T7.1 144.01,46.33 v143.76,46.74 | IC4.25 91.45,39.86 v93.47,37.85 | v97.03,39.62 97.28,39.88 v97.28,42.67
  Bottom 0.406: v143.76,46.74 143.76,47.5 140.21,51.05 118.11,51.05 111,43.94 98.55,43.94 v97.28,42.67 | v93.47,37.85 95.25,37.85 v97.03,39.62
LED_G  (via drill 0.6)  (1 unrouted)
  Top 0.406: v144.02,5.84 143.99,8.41 143.99,11.15 145.54,12.7 145.54,13.95 U$7.G_CATH | v122.02,5.59 122,8.55 122,11.51 123.7,13.21 123.7,14.02 U$6.G_CATH | v89.97,5.59 89.98,8.06 89.98,11.24 91.69,12.95 91.69,13.97 U$5.G_CATH | v67.97,5.54 67.97,6.7 67.97,11.33 69.6,12.95 69.6,14.05 U$4.G_CATH | v35.81,5.59 36,6.67 36,11.62 37.59,13.21 37.59,14 U$3.G_CATH | v13.97,5.84 13.98,6.61 13.98,11.19 15.66,12.86 U$1.G_CATH | v4.06,24.89 4.06,26.63 T8.4 7.84,29.43 7.87,29.46
  Bottom 0.406: v144.02,5.84 143.76,6.1 138.94,6.1 138.18,5.33 122.28,5.33 v122.02,5.59 121.51,6.1 112.27,6.1 109.5,3.33 102.84,3.33 100.84,5.33 90.22,5.33 v89.97,5.59 89.46,6.1 84.07,6.1 83.57,5.59 68.02,5.59 v67.97,5.54 67.87,5.54 67.31,6.1 58.67,6.1 55.88,3.3 48.26,3.3 45.97,5.59 v35.81,5.59 35.56,5.84 v13.97,5.84 11.43,8.38 6.6,8.38 3.81,11.18 3.81,24.64 v4.06,24.89
LED_R  (via drill 0.6)  (1 unrouted)
  Top 0.406: v147.83,7.11 147.83,9.65 146.3,11.68 146.3,12.19 146.81,12.7 146.81,15.49 146.3,16 144.53,16 144,15.48 U$7.R_CATH | v126.49,7.11 126.49,9.14 125.48,10.16 124.46,11.68 124.71,12.45 124.71,15.49 124.21,16 122.94,16 121.96,15.02 U$6.R_CATH | v18.19,7.21 17.27,8.13 17.27,9.91 16.51,11.68 16.51,12.45 17.02,12.95 17.02,15.49 16.51,16 14.73,16 13.96,15.23 U$1.R_CATH | v71.63,7.11 71.63,9.91 70.36,11.68 70.36,12.19 70.87,12.95 70.87,15.49 70.36,16 68.58,16 67.96,15.38 U$4.R_CATH | v93.47,7.11 93.47,9.91 92.46,11.68 92.46,12.45 92.96,12.95 92.96,15.24 92.46,15.75 90.68,15.75 89.95,15.02 U$5.R_CATH | v39.62,7.11 39.62,9.91 38.35,11.68 38.35,12.19 38.86,12.95 38.86,15.24 38.1,16 36.83,16 36,15.18 U$3.R_CATH | T9.4 79.61,10.52 v76.2,7.11
  Bottom 0.406: v147.83,7.11 v126.49,7.11 111.76,7.11 108.97,4.32 103.38,4.32 100.58,7.11 v93.47,7.11 | v93.47,7.11 v76.2,7.11 v71.63,7.11 57.91,7.11 55.12,4.32 49.02,4.32 46.23,7.11 v39.62,7.11 18.29,7.11 v18.19,7.21 | v93.47,7.11 94.74,7.11
MIN_1_0  (via drill 0.6)
  Top 0.406: v93.22,26.16 97.28,22.1 113.54,22.1 120.48,29.04 IC2.44
  Bottom 0.406: N4.0 83.82,21.02 83.82,22.61 87.63,26.42 92.96,26.42 v93.22,26.16
MIN_1_1  (via drill 0.6)
  Top 0.406: IC2.43 121.29,29.84 120.4,30.73 v120.4,31.24
  Bottom 0.406: N4.1 97.48,22.35 98.81,22.35 103.12,26.67 113.54,26.67 118.11,31.24 v120.4,31.24
MIN_1_2  (via drill 0.6)
  Top 0.406: v125.53,30.12 125.07,30.64 IC2.42
  Bottom 0.406: N4.2 99.82,20.88 99.82,21.59 103.89,25.65 114.05,25.65 118.11,29.72 125.22,29.72 v125.53,30.12
MIN_1_3  (via drill 0.6)
  Top 0.406: v128.27,32.26 127.45,31.44 IC2.41
  Bottom 0.406: N4.3 100.84,19.31 100.84,20.83 104.65,24.64 114.55,24.64 118.62,28.7 126.24,28.7 128.27,30.73 v128.27,32.26
MIN_1_4  (via drill 0.6)
  Top 0.406: v129.54,33.78 127.76,33.78 126.24,32.26 122.78,32.26 IC2.40
  Bottom 0.406: N4.4 97.91,11.8 101.85,15.75 101.85,20.32 105.16,23.62 115.06,23.62 119.13,27.69 126.75,27.69 129.54,30.48 v129.54,33.78
MIN_1_5  (via drill 0.6)
  Top 0.406: v130.81,35.31 128.02,35.31 125.75,33.04 IC2.39
  Bottom 0.406: N4.5 92.24,9.65 97.28,9.65 102.87,15.24 102.87,19.81 105.66,22.61 115.57,22.61 119.63,26.67 127.25,26.67 130.81,30.23 v130.81,35.31
MIN_1_6  (via drill 0.6)
  Top 0.406: IC2.38 120.7,33.84 118.62,31.75 118.62,28.7 113.03,23.11 98.3,23.11 v97.54,23.88
  Bottom 0.406: N4.6 88.5,13.1 88.14,13.46 88.14,19.3 88.65,19.81 88.65,21.34 88.39,23.37 89.41,24.38 90.93,24.38 91.69,23.62 96.77,23.62 97.03,23.88 v97.54,23.88
MIN_1_7  (via drill 0.6)
  Top 0.406: IC2.37 119.98,34.64 117.6,32.26 117.6,29.21 112.52,24.13 100.08,24.13 v99.31,24.89
  Bottom 0.406: N4.7 87.12,13.05 87.12,19.81 84.84,22.1 88.14,25.4 91.69,25.4 92.46,24.64 96.27,24.64 97.03,25.4 98.3,25.4 98.81,24.89 v99.31,24.89
MIN_1_8  (via drill 0.6)
  Top 0.406: IC2.36 119.26,35.44 116.59,32.77 116.59,29.72 112.01,25.15 101.09,25.15 100.08,26.16 v95.5,26.16
  Bottom 0.406: N4.8 84.85,14.24 86.11,15.49 86.11,17.27 85.34,18.03 82.8,19.3 82.55,19.56 82.55,22.86 87.12,27.43 94.23,27.43 v95.5,26.16
MIN_1_9
  Top 0.406: N4.9 83.84,18.02 82.8,19.05 82.8,20.83 89.66,27.69 97.03,27.69 97.54,27.18 100.58,27.18 101.6,26.16 111.51,26.16 115.57,30.23 115.57,33.27 118.53,36.24 IC2.35
MIN_10_0
  Top 0.406: N3.0 64.4,19.95 64.52,20.07 66.29,20.57 67.06,20.83 66.29,23.11 64.21,25.2 IC1.22
MIN_10_1  (via drill 0.6)
  Top 0.406: IC1.21 63.41,27.59 v62.48,26.67
  Bottom 0.406: N3.1 73.29,19.95 74.17,20.83 74.17,22.61 70.36,26.42 63.5,26.42 63.25,26.67 v62.48,26.67
MIN_10_2  (via drill 0.6)
  Top 0.406: IC1.20 62.61,31.11 v63.75,32.26
  Bottom 0.406: N3.2 74.59,17.18 76.2,18.8 76.2,23.62 71.37,28.45 64.77,28.45 63.75,29.46 v63.75,32.26
MIN_10_3  (via drill 0.6)
  Top 0.406: IC1.19 61.81,31.92 v61.72,32.26
  Bottom 0.406: N3.3 72.39,15.62 72.39,18.03 75.18,19.3 75.18,23.11 70.87,27.43 64.26,27.43 61.72,29.97 v61.72,32.26
MIN_10_4  (via drill 0.6)
  Top 0.406: v62.48,24.38 61.01,25.86 IC1.18
  Bottom 0.406: N3.4 72.09,11.98 71.12,12.95 71.12,20.07 72.9,21.84 72.9,22.35 69.85,25.4 63.5,25.4 v62.48,24.38
MIN_10_5  (via drill 0.6)
  Top 0.406: v62.48,22.1 60.21,24.38 IC1.17
  Bottom 0.406: N3.5 69.47,12.57 69.85,12.95 69.85,18.54 69.34,19.05 69.34,20.57 69.09,20.83 69.6,22.86 69.6,23.37 68.58,24.38 64.77,24.38 v62.48,22.1
MOSI  (via drill 0.6)
  Top 0.406: IC1.32 73.32,38.69 v73.91,38.1 | R34.1 v69.85,51.82 70.1,52.07 72.56,52.07 T10.3
  Bottom 0.406: v73.91,38.1 73.91,38.35 69.85,42.42 69.85,44.2 67.82,46.23 67.82,49.28 69.85,51.31 v69.85,51.82
N$2
  Top 0.406: IC4.29 92.56,43.06 RST.MP
  Bottom 0.406: 93.22,42.35 RST.MP 93.47,42.1 93.47,46.74 92.05,48.16 R39.1
N$3
  Top 0.406: R1.1 43.98,30.43 R2.2 42.44,30.8 IC3.7
N$4
  Top 0.406: IC3.5 39.38,33.78 34.73,38.42 T1.C 38.49,43.43 44.09,43.43 R3.1
N$5  (via drill 0.6)
  Top 0.406: C2.1 36.83,30.13 | 36.83,30.13 39.67,30.13 R2.1 41.17,31.63 IC3.6 | v36.58,34.54 36.58,30.38 36.83,30.13 | IC3.2 42.44,40.91 v43.18,41.66
  Bottom 0.406: v36.58,34.54 43.18,41.15 v43.18,41.66
N$6  (via drill 0.6)
  Top 0.406: IC3.3 41.17,40.88 v40.39,41.66 | T2.1 17.96,41.33 22.61,45.97 26.67,45.97 29.46,43.18 v34.29,43.18
  Bottom 0.406: v40.39,41.66 38.61,41.66 37.08,43.18 v34.29,43.18
N$7  (via drill 0.6)
  Top 0.406: R4.2 20.91,33.7 v20.07,34.54
  Top 1.016: v8.38,49.53 8.38,44.68 T2.3 | D1.A 25.35,43.48 v24.64,44.2
  Bottom 0.406: v20.07,34.54 20.07,43.94 19.81,44.2
  Bottom 1.016: L1.P$2 11.4,52.55 v8.38,49.53 13.72,44.2 19.81,44.2 v24.64,44.2
N$8
  Top 0.406: R5.1 26.89,32.74 29.21,35.05 29.21,38.35 30.22,39.37 T1.B 31.5,39.59 31.5,40.13 32.51,41.15 34.29,41.15 40.89,47.75 40.89,51.84 P1.1 52.03,55.35 P1.3
N$9
  Top 0.406: C3.1 20.86,40.13 19.05,40.13 18.03,39.12 18.03,30.23 18.67,29.59 R4.1
N$10  (via drill 0.6)
  Top 0.406: v31.24,34.8 31.24,34.41 R6.2
  Bottom 0.406: v31.24,34.8 29.97,36.07 29.97,40.64 33.78,44.45 38.59,44.45 P1.2
N$11
  Bottom 0.406: N1.A 13.98,20.29 R12.1
N$12
  Bottom 0.406: N2.A 35.98,19.96 R11.1
N$13
  Bottom 0.406: N3.A 67.98,19.87 R10.1
N$14
  Bottom 0.406: N4.A 89.98,19.93 R9.1
N$15
  Bottom 0.406: N5.A 121.98,19.92 R8.1
N$16
  Bottom 0.406: N6.A R7.1
N$17
  Top 0.406: MISO.MP 80.85,38.04 IC4.16
N$18
  Bottom 0.406: R13.1 107.92,16.63 GL2.A
N$19  (via drill 0.6)
  Top 0.406: v78.23,42.93 78.89,42.26 IC4.13 | T6.1 109.15,31.31 105.92,34.54 101.35,34.54 99.06,32.26 90.93,32.26 v89.15,34.04
  Bottom 0.406: v78.23,42.93 85.34,35.81 87.38,35.81 v89.15,34.04
N$20
  Top 0.406: R16.1 7.37,6.91 7.37,11.68 10.67,14.22 10.67,15.24 11.43,16 12.19,16 13.21,17.02 14.73,17.02 15.66,17.94 U$1.G_ANODE
N$21
  Top 0.406: R17.1 5.84,8.74 5.84,15.49 9.65,16 12.26,18.61 U$1.B_ANODE
N$22
  Top 0.406: R18.1 20.32,12.19 17.78,13.72 17.78,17.53 17.02,18.29 17.02,19.81 16.26,20.57 14.73,20.57 13.96,19.8 U$1.R_ANODE
N$23
  Top 0.406: IC4.8 82.35,49.87 Q1.2
  Bottom 0.406: Q1.2 79.73,54.74 C8.1
N$24
  Bottom 0.406: GL3.A 53.16,21.15 54.49,22.49 R32.1
N$26
  Top 0.406: R19.1 28.96,11.68 32.51,13.97 32.77,14.22 32.77,15.49 34.29,17.02 36.58,17.02 37.7,18.14 U$3.G_ANODE
N$27
  Top 0.406: R20.1 27.43,8.98 27.43,15.49 32,16 34.3,18.3 U$3.B_ANODE
N$28
  Top 0.406: R21.1 42.67,5.88 42.67,11.94 39.88,13.72 39.62,13.97 39.62,19.3 38.35,20.57 36.83,20.57 36,19.75 U$3.R_ANODE
N$29  (via drill 0.6)
  Top 0.406: v82.8,43.18 82.69,43.06 IC4.12 | v123.19,46.74 124.26,45.66 T5.1
  Bottom 0.406: v123.19,46.74 117.35,46.74 113.03,42.42 113.03,38.61 110.24,35.81 104.65,35.81 103.12,34.29 91.44,34.29 89.15,36.58 89.15,40.64 86.61,43.18 v82.8,43.18
N$30
  Bottom 0.406: GL4.A 107.7,19.37 R33.1
N$31
  Top 0.406: IC4.7 83.15,51.07 Q1.1
  Bottom 0.406: Q1.1 84.56,54.29 C9.1
N$32
  Top 0.406: R22.1 61.47,6 61.47,11.94 64.52,13.97 64.77,14.22 64.77,15.49 66.29,17.02 69.34,17.02 69.66,17.33 U$4.G_ANODE
N$33
  Top 0.406: R23.1 59.94,8.49 59.94,15.49 63.75,16 66.26,18.5 U$4.B_ANODE
N$34
  Top 0.406: R24.1 73.85,10.86 73.91,12.45 71.88,13.72 71.88,19.05 70.36,20.57 68.83,20.57 67.96,19.7 U$4.R_ANODE
N$35
  Top 0.406: IC4.17 82.35,34.76 SCK.MP 80.35,32.77 75.44,32.77 73.41,30.73 73.41,29.72 71.37,27.69 T3.1
N$38
  Top 0.406: R25.1 83.31,5.98 83.31,11.94 86.61,13.97 86.61,15.49 88.14,17.02 90.93,17.02 91.65,17.74 U$5.G_ANODE
N$39
  Top 0.406: R26.1 79.08,5.92 81.79,8.64 81.79,15.24 82.04,15.49 85.6,16 88.25,18.66 U$5.B_ANODE
N$40
  Top 0.406: R27.1 98.17,10.55 97.03,11.68 93.98,13.72 93.73,13.97 93.73,19.05 92.2,20.57 90.68,20.57 89.95,19.85 U$5.R_ANODE
N$41
  Top 0.406: IC4.15 79.02,40.66 77.9,39.55 MOSI.MP 77.85,38.86 76.45,38.86 73.91,41.4 73.91,44.2 71.69,46.42 T10.1
N$43  (via drill 0.6)
  Top 0.406: v87.12,34.54 90.36,31.31 99.38,31.31 99.82,31.75 101.85,31.75 102.55,31.05 T4.1 | IC4.11 76.38,43.86 v75.95,43.43
  Bottom 0.406: v87.12,34.54 84.84,34.54 v75.95,43.43
N$44
  Top 0.406: R28.1 115.57,6.6 115.57,7.37 115.57,12.06 118.75,13.97 118.87,14.1 118.87,15.75 120.14,17.02 122.94,17.02 123.66,17.74 U$6.G_ANODE
N$45
  Top 0.406: R29.1 113.54,8.02 113.54,15.24 117.6,16 120.26,18.66 U$6.B_ANODE
N$46
  Top 0.406: R30.1 129.03,11.17 129.03,11.18 125.73,13.97 125.73,19.3 124.46,20.57 122.68,20.57 121.96,19.85 U$6.R_ANODE
N$50
  Top 0.406: R31.1 137.67,7.53 137.67,12.19 140.48,13.94 140.72,14.17 140.72,15.75 141.99,17.02 145.03,17.02 145.7,17.69 U$7.G_ANODE
N$51
  Top 0.406: R35.1 136.19,8.71 136.19,15.39 139.27,15.96 142.23,18.91 U$7.B_ANODE
N$52
  Top 0.406: R36.1 150.38,12.19 150.37,12.19 147.99,13.68 147.83,13.85 147.83,19.05 146.3,20.57 144.53,20.57 144,20.05 U$7.R_ANODE
N$146
  Bottom 0.406: GL1.A 54.2,17.12 R46.1
POL  (via drill 0.6)
  Top 0.406: IC2.27 129.75,40.6 v130.81,41.66 | v112.01,28.96 111.13,28.07 R37.1 104.02,29.58 T4.3 | IC1.27 67.93,34.69 68.33,34.29 68.33,33.27 v68.58,33.02
  Bottom 0.406: v130.81,41.66 130.3,41.66 126.49,37.85 121.67,37.85 112.78,28.96 v112.01,28.96 111.76,28.7 96.27,28.7 95.5,29.46 85.85,29.46 85.09,28.7 76.45,28.7 73.15,32 69.6,32 v68.58,33.02
RST  (via drill 0.6)
  Top 0.406: U$2.RST 106.72,37.63 104.65,35.56 93.47,35.56 v91.19,37.85 | v92.2,45.97 91.69,45.46 IC4.32
  Bottom 0.406: v92.2,45.97 91.19,44.96 v91.19,37.85
SEC_1_0
  Top 0.406: N6.0 138.89,22.3 147.57,30.99 147.57,35.05 144.53,38.1 136.91,38.1 135.84,37.04 IC2.22
SEC_1_1  (via drill 0.6)
  Top 0.406: IC2.21 137.84,36.24 v138.43,36.83
  Bottom 0.406: N6.1 149.35,20.23 149.35,23.37 147.83,24.89 147.32,24.89 145.29,26.92 145.29,31.24 139.7,36.83 v138.43,36.83
SEC_1_2  (via drill 0.6)
  Top 0.406: IC2.20 140.85,35.44 v141.99,36.58
  Bottom 0.406: N6.2 150.88,17.93 150.88,23.37 148.34,25.91 147.83,25.91 146.3,27.43 146.3,31.75 141.99,36.07 v141.99,36.58
SEC_1_3  (via drill 0.6)
  Top 0.406: IC2.19 145.29,34.64 145.8,34.13 v146.05,34.04
  Bottom 0.406: N6.3 151.89,16.36 151.89,23.88 148.84,26.92 148.34,26.92 147.32,27.94 147.32,32.77 v146.05,34.04
SEC_1_4  (via drill 0.6)
  Top 0.406: IC2.18 141.42,33.84 143.76,31.5 v143.76,30.48
  Bottom 0.406: N6.4 146.81,13.08 146.81,19.81 148.34,21.34 148.34,22.86 147.32,23.88 146.81,23.88 143.76,26.92 v143.76,30.48
SEC_1_5  (via drill 0.6)
  Top 0.406: IC2.17 140.45,33.04 142.24,31.24 142.24,29.21 v141.99,28.96
  Bottom 0.406: N6.5 145.47,13.13 145.8,13.46 145.8,19.56 145.29,20.07 145.29,21.59 145.57,23.14 145.57,23.6 141.99,27.18 v141.99,28.96
SEC_1_6  (via drill 0.6)
  Top 0.406: IC2.16 138.96,32.24 v140.72,30.48
  Bottom 0.406: N6.6 142.5,13.2 142.24,13.46 142.24,19.56 142.75,20.07 142.75,21.34 142.24,23.88 142.24,25.4 140.72,26.92 v140.72,30.48
SEC_1_7  (via drill 0.6)
  Top 0.406: IC2.15 138.24,31.44 139.19,30.48 139.19,26.42 138.68,25.91 v138.68,24.64
  Bottom 0.406: N6.7 141.22,13.15 141.22,19.71 138.68,22.35 138.68,24.13 v138.68,24.64
SEC_1_8  (via drill 0.6)
  Top 0.406: IC2.14 137.51,30.64 138.18,29.97 138.18,26.92 v135.64,24.38
  Bottom 0.406: v135.64,24.38 135.64,16.8 N6.8
SEC_1_9  (via drill 0.6)
  Top 0.406: IC2.13 136.79,29.84 137.16,29.46 137.16,28.45 v135.64,26.92
  Bottom 0.406: N6.9 137.16,17.86 137.16,25.65 135.89,26.92 v135.64,26.92
SEC_10_0  (via drill 0.6)
  Top 0.406: IC2.12 133.27,29.04 v132.08,30.23
  Bottom 0.406: N5.0 116.84,20 116.84,22.35 119.38,24.89 130.05,24.89 131.7,26.54 131.7,29.59 v132.08,30.23
SEC_10_1  (via drill 0.6)
  Top 0.406: IC2.11 132.95,23.76 v133.86,22.86
  Bottom 0.406: v133.86,22.86 130.3,22.86 127.39,19.95 N5.1
SEC_10_2  (via drill 0.6)
  Top 0.406: IC2.10 132.15,22.28 v133.86,20.57
  Bottom 0.406: v133.86,20.57 130.47,17.18 N5.2
SEC_10_3  (via drill 0.6)
  Top 0.406: IC2.9 131.35,20.54 v134.11,17.78
  Bottom 0.406: v134.11,17.78 130.57,14.24 N5.3
SEC_10_4  (via drill 0.6)
  Top 0.406: v129.54,19.56 130.55,20.57 IC2.8
  Bottom 0.406: N5.4 126.09,17.63 126.49,18.03 v129.54,19.56
SEC_10_5  (via drill 0.6)
  Top 0.406: v127.76,22.86 129.79,24.89 129.79,26.8 IC2.7
  Bottom 0.406: N5.5 123.47,12.97 123.95,13.46 123.95,18.8 125.22,20.07 127.25,22.35 v127.76,22.86
V+  (via drill 0.6)
  Top 0.406: v24.89,27.43 25.64,28.18 R5.2 | v22.1,21.59 23.88,19.81 v23.88,8.64
  Top 1.016: D1.K 26.61,36.89 v27.43,36.07
  Bottom 0.406: R7.2 143.98,8.92 143.7,8.64 121.92,8.64 | R8.2 121.94,8.66 121.92,8.64 | 121.92,8.64 115.32,8.64 110.17,13.78 | R10.2 67.99,8.62 | 67.99,8.62 68.07,8.64 90.17,8.64 | 67.99,8.62 61.74,8.62 56.39,13.97 | 56.39,13.97 55.57,14.78 55.75,14.28 | R11.2 35.99,8.65 36.07,8.64 | 36.07,8.64 41.91,8.64 47.55,14.28 55.75,14.28 | R12.2 13.94,8.92 14.22,8.64 v23.88,8.64 36.07,8.64 | 90.17,8.64 97.79,8.64 103.12,13.97 109.98,13.97 110.17,13.78 | 110.17,13.78 R13.2 112.52,15.98 112.52,19.29 R33.2 | 55.75,14.28 R46.2 | 56.39,13.97 57.91,15.49 57.91,19.53 R32.2 | v22.1,21.59 22.1,24.64 v24.89,27.43 27.43,29.97 v27.43,36.07 | R9.2 89.94,8.86 90.17,8.64
  Bottom 1.016: C4.+ 27.43,43.72 27.43,36.58 v27.43,36.07
(copper drawn outside any net)
  shapes: Top area x5

### Text on the board
tPlace: - | + | L1 | C4 | P1 | C10 | Q1 | VCC | C1 | R34 | T10 | IC5 | T7 | T2 | C7 | IC4 | C6 | T5 | R3 | R38 | RST | IC1 | R14 | T1 | MOSI | IC2 | C3 | D1 | IC3 | SCK | R1 | MISO | T6 | T4 | R4 | R5 | R6 | C2 | R15 | R2 | T9 | R37 | T3 | T8 | R16 | R19 | R22 | R25 | R28 | R31 | R27 | R36 | R17 | R18 | R20 | R21 | R23 | R24 | R26 | R29 | R30 | R35
bPlace: C8 | C9 | R39 | C5 | R32 | R33 | R12 | R11 | R9 | R8 | R7 | R46 | R10 | R13